# Altium schematic sheet 12-multimodal-RTC.SchDoc
size A4; SheetNumber: 13; SheetTotal: 12
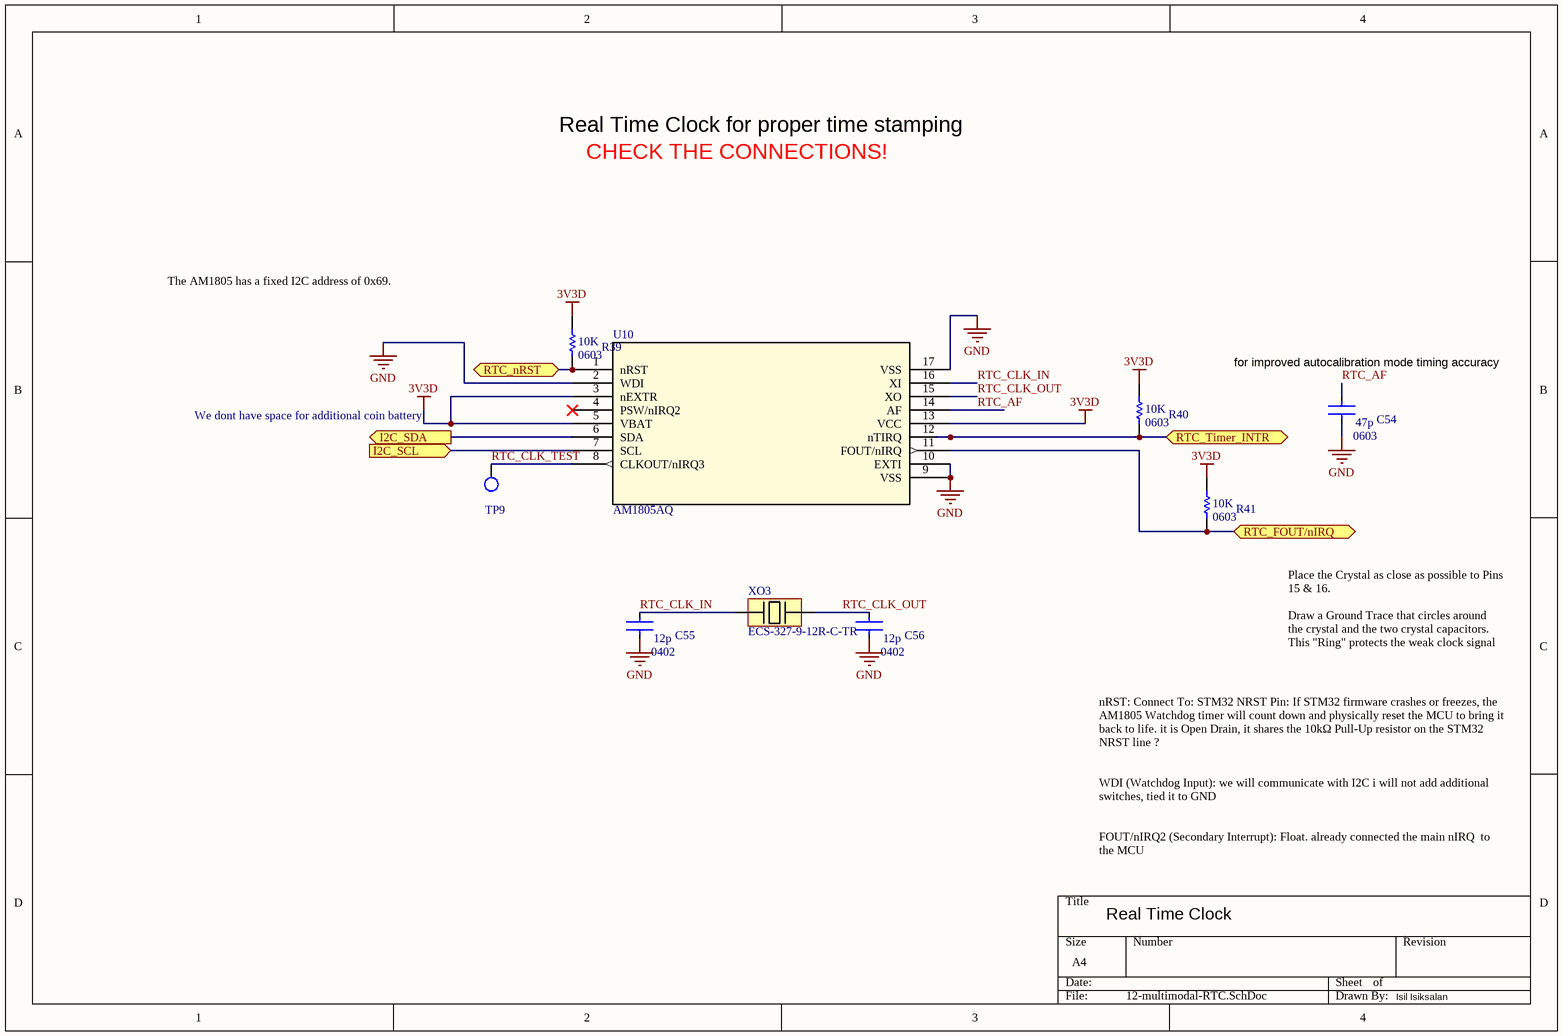
[diagram p0: 12-multimodal-RTC.SchDoc]

## Parts
C54  CGA3E2C0G1H470J080AA  [CAPTDK0603]  (value not drawn)
C55  CGA2B2C0G1H120J050BA  [CAPTDK0402]  (value not drawn)
C56  CGA2B2C0G1H120J050BA  [CAPTDK0402]  (value not drawn)
R39  RMCF0603JG10K0  [RES-STACK-POLE-0603]  (value not drawn)
R40  RMCF0603JG10K0  [RES-STACK-POLE-0603]  (value not drawn)
R41  RMCF0603JG10K0  [RES-STACK-POLE-0603]  (value not drawn)
TP9  TESTPOINT_S  [TESTPOINT_S]  (value not drawn)  (no BOM)
U10  AM1805AQ  [QFN16_AM1805AQ_ABQ]
XO3  ECS-327-9-12R-C-TR  [LSE-32K]

## Ports
I2C_SCL (in), I2C_SDA (out), RTC_FOUT/nIRQ (bidir), RTC_nRST (bidir), RTC_Timer_INTR (bidir)

## Nets
3V3D: R39.2 R40.2 R41.2 U10.3(nEXTR) U10.5(VBAT) U10.13(VCC)
GND: C54.2 C55.2 C56.2 U10.2(WDI) U10.9(VSS) U10.10(EXTI) U10.17(VSS)
I2C_SCL: U10.7(SCL) ; port I2C_SCL
I2C_SDA: U10.6(SDA) ; port I2C_SDA
RTC_AF: C54.1 U10.14(AF)
RTC_CLK_IN: C55.1 U10.16(XI) XO3.1
RTC_CLK_OUT: C56.1 U10.15(XO) XO3.2
RTC_CLK_TEST: TP9.1 U10.8(CLKOUT/nIRQ3)
RTC_FOUT/nIRQ: R41.1 U10.11(FOUT/nIRQ) ; port RTC_FOUT/nIRQ
RTC_nRST: R39.1 U10.1(nRST) ; port RTC_nRST
RTC_Timer_INTR: R40.1 U10.12(nTIRQ) ; port RTC_Timer_INTR

Not connected (* = marked no-connect by the designer): U10 4(PSW/nIRQ2)*

## Notes on the sheet
- Real Time Clock for proper time stamping
- CHECK THE CONNECTIONS!
- The AM1805 has a fixed I2C address of 0x69. Check for adress conflict. The ADXL367 uses completely different addresses (0x1D or 0x53).
- We dont have space for additional coin battery
- (near C54) for improved autocalibration mode timing accuracy
- Place the Crystal as close as possible to Pins 15 & 16.
  Draw a Ground Trace that circles around the crystal and the two crystal capacitors. This "Ring" protects the weak clock signal
- nRST: Connect To: STM32 NRST Pin: If STM32 firmware crashes or freezes, the AM1805 Watchdog timer will count down and physically reset the MCU to bring it back to life. it is Open Drain, it shares the 10kΩ Pull-Up resistor on the STM32 NRST line ?
  WDI (Watchdog Input): we will communicate with I2C i will not add additional switches, tied it to GND
  FOUT/nIRQ2 (Secondary Interrupt): Float. already connected the main nIRQ  to the MCU
- Real Time Clock
- Isil Isiksalan
- (in symbol CGA2B2C0G1H120J050BA) 12p; 0402
- (in symbol CGA3E2C0G1H470J080AA) 47p; 0603
- (in symbol RMCF0603JG10K0) 10K; 0603

## Library data of the parts
C54 = CGA3E2C0G1H470J080AA: CAP CER 47PF 50V C0G 0603; Supplier 1: Avnet; Supplier Part Number 1: CGA3E2C0G1H470J080AA
C55 C56 = CGA2B2C0G1H120J050BA: CAP CER 12PF 50V C0G 0402; Supplier 1: Digi-Key; Supplier Part Number 1: 445-5585-1-ND
R39-R41 = RMCF0603JG10K0: RES 10K OHM 5% 1/10W 0603; Supplier 1: Digi-Key; Supplier Part Number 1: 738-RMCF0603JG10K0CT-ND
TP9 = TESTPOINT_S: Testpoint Surface Pad
U10 = AM1805AQ: RTC ARTASIE I2C W/PWR MNGT 16QFN; Manufacturer_Name: Ambiq Micro; Manufacturer_Part_Number: AM1815AQ; Copyright: Copyright (C) 2026 Ultra Librarian. All rights reserved.; RefDes: RefDes; Type: Type; Supplier 1: DigiKey; Supplier Part Number 1: 5128-AM1805AQCT-ND
XO3 = ECS-327-9-12R-C-TR: Crystal 0.032768MHz ±10ppm (Tol) 9pF Flexural 70000Ohm Automotive 2-Pin Ultra Mini-CSMD T/R; Manufacturer: ECS International; Manufacturer Part Number: ECS-.327-9-12R-C-TR; Frequency: 32.768kHz; ESR (Equivalent Series Resistance): 70kR; Supplier 1: Digi-Key; RoHS: Yes; Stock 1: 152; Pricing 1: 1=0.79000, 10=0.65700, 50=0.59160, 100=0.52580, 500=0.49952, 1000=0.42064 (USD); Mount: Surface Mount; Case/Package: SMD/SMT; Min Operating Temperature: -40°C; Max Operating Temperature: 85°C; Packaging: Tape and Reel; Frequency Tolerance: 10ppm; Load Capacitance: 9pF; ComponentLink1URL: https://www.ecsxtal.com/store/pdf/ECX-12R.pdf?src-supplier=Digi-Key; ComponentLink1Description: https://www.ecsxtal.com/store/pdf/ECX-12R.pdf?src-supplier=Digi-Key; Supplier Part Number 1: XC2744CT-ND